# EAGLE schematic myattempt1 (EAGLE 7.4.0)
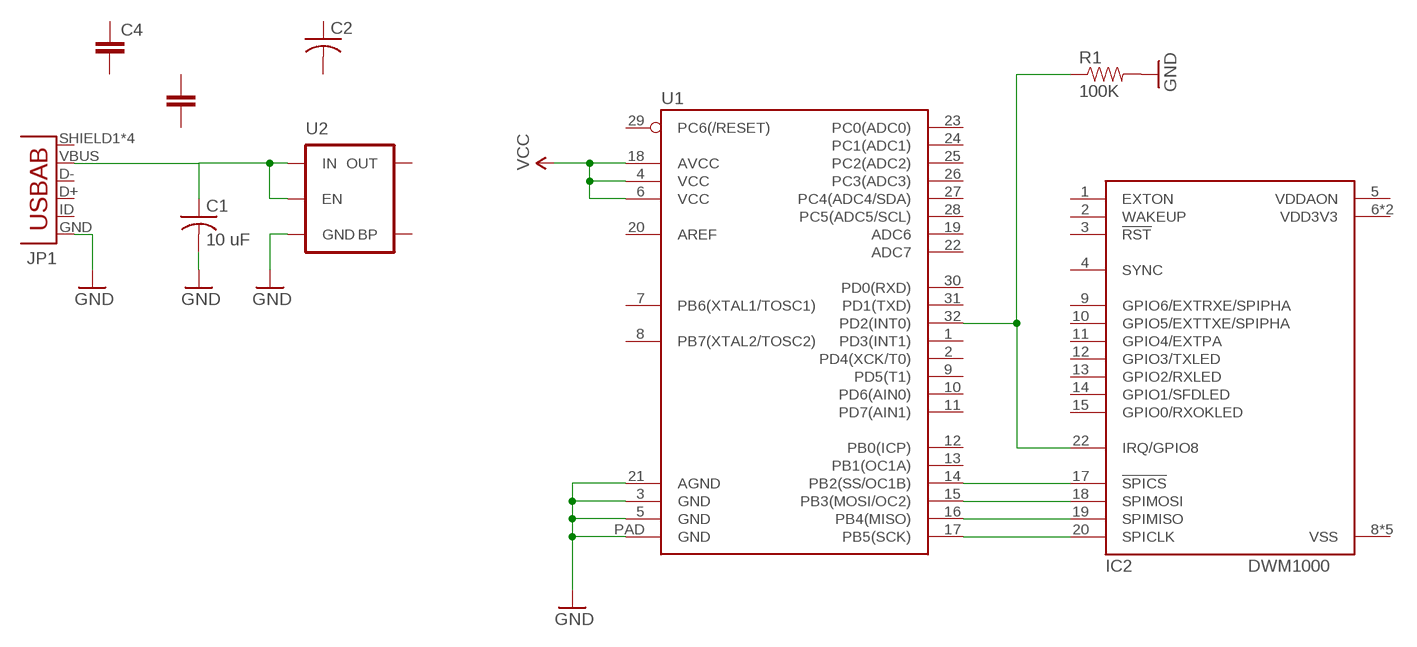
[diagram p0: schematic, sheet 1]

## Parts
C1  10 uF  C-US025-024X044  [C025-024X044]
C2  C-US025-024X044  [C025-024X044]
C4  CAP0402-CAP  [0402-CAP]
IC2  DWM1000  [DWM1000]
JP1  USB-AB  [USB-AB-MICRO-SMD]
R1  100K  RESISTOR0402  [0402-RES]
U1  ATMEGA328P_MLFMLF32  [MLF32-PAD]
U2  MIC52053.3V  [SOT23-5]

## Nets
GND: C1.2 JP1.GND R1.2 U1.3(GND) U1.5(GND) U1.21(AGND) U1.PAD(GND) U2.2(GND)
N$1: IC2.20(SPICLK) U1.17(PB5(SCK))
N$2: IC2.19(SPIMISO) U1.16(PB4(MISO))
N$3: IC2.18(SPIMOSI) U1.15(PB3(MOSI/OC2))
N$4: IC2.22(IRQ/GPIO8) R1.1 U1.32(PD2(INT0))
N$5: IC2.17(!SPICS) U1.14(PB2(SS/OC1B))
N$8: C1.1 JP1.VBUS U2.1(IN) U2.3(EN)
VCC: U1.4(VCC) U1.6(VCC) U1.18(AVCC)
Unconnected: C2.1 C2.2 C4.1 C4.2 IC2.1(EXTON) IC2.2(WAKEUP) IC2.3(!RST) IC2.4(SYNC) IC2.5(VDDAON) IC2.6(VDD3V3) IC2.7(VDD3V3) IC2.8(VSS) IC2.9(GPIO6/EXTRXE/SPIPHA) IC2.10(GPIO5/EXTTXE/SPIPHA) IC2.11(GPIO4/EXTPA) IC2.12(GPIO3/TXLED) IC2.13(GPIO2/RXLED) IC2.14(GPIO1/SFDLED) IC2.15(GPIO0/RXOKLED) IC2.16(VSS) IC2.21(VSS) IC2.23(VSS) IC2.24(VSS) JP1.D+ JP1.D- JP1.ID(USBID) JP1.SHIELD1(SHIELD) JP1.SHIELD2(SHIELD) JP1.SHIELD3(SHIELD) JP1.SHIELD4(SHIELD) U1.1(PD3(INT1)) U1.2(PD4(XCK/T0)) U1.7(PB6(XTAL1/TOSC1)) U1.8(PB7(XTAL2/TOSC2)) U1.9(PD5(T1)) U1.10(PD6(AIN0)) U1.11(PD7(AIN1)) U1.12(PB0(ICP)) U1.13(PB1(OC1A)) U1.19(ADC6) U1.20(AREF) U1.22(ADC7) U1.23(PC0(ADC0)) U1.24(PC1(ADC1)) U1.25(PC2(ADC2)) U1.26(PC3(ADC3)) U1.27(PC4(ADC4/SDA)) U1.28(PC5(ADC5/SCL)) U1.29(PC6(/RESET)) U1.30(PD0(RXD)) U1.31(PD1(TXD)) U2.4(BP) U2.5(OUT)

## Library data of the parts
C1 C2 = adafruit:C-US: CAPACITOR, American symbol
C4 = SparkFun-Capacitors:CAP: Capacitor Standard 0603 ceramic capacitor, and 0.1" leaded capacitor.
IC2 = decawave:DWM1000
JP1 = SparkFun-Connectors:USB-AB: This is a USB AB connector that is compatible with USB OTG. i.e. this connector can serve as a host or device
R1 = SparkFun-Resistors:RESISTOR: Resistor Basic schematic elements and footprints for 0603, 1206, and PTH resistors.
U1 = SparkFun-DigitalIC:ATMEGA328P_MLF: 32-Pin Atmega328 part Commonly used on Arduino compatible boards Available in QFP and QFN packages TQFP is IC-09069 QFN is non-stock
U2 = SparkFun-PowerIC:MIC5205: MIC5205 150mA vreg 3.3V - VREG-00822 5V - VREG-00823; PROD_ID: VREG-00822